# Altium schematic sheet Power.SchDoc
size A
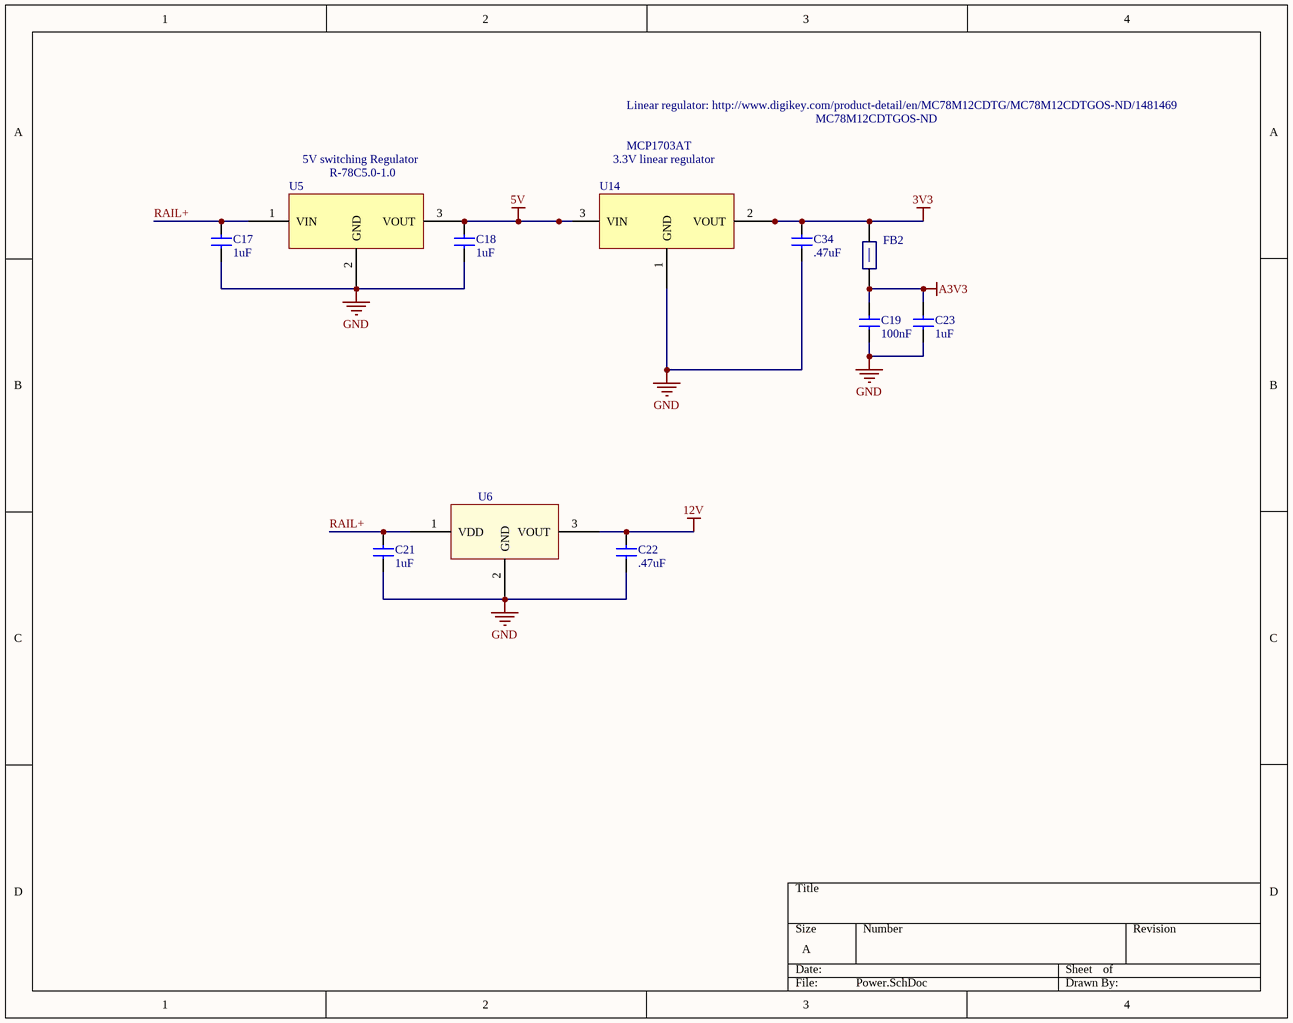
[diagram p0: Power.SchDoc]

## Parts
C17  value 1uF  [CAPC0603]  (hidden comment: Cap)
C18  value 1uF  [CAPC0603]  (hidden comment: Cap)
C19  value 100nF  [CAPC0603]  (hidden comment: Cap)
C21  value 1uF  [CAPC0603]  (hidden comment: Cap)
C22  value .47uF  [CAPC0603]  (hidden comment: Cap)
C23  value 1uF  [CAPC0603]  (hidden comment: Cap)
C34  value .47uF  [CAPC0603]  (hidden comment: Cap)
FB2  FBead  [RES0603]  (value not drawn)
U5  R-78C5.0-1.0  [R-78C5.0-1.0]
U6  MC78M12CDTG  [MC78M12CDTG]  (value not drawn)
U14  MCP1703AT  [MCP1703AT-xx02EMB]

## Nets
3V3: C34.1(A) FB2.2(B) U14.2(VOUT)
5V: C18.1(A) U5.3(VOUT) U14.3(VIN)
12V: C22.1(A) U6.3(VOUT)
A3V3: C19.1(A) C23.1(A) FB2.1(A)
GND: C17.2(B) C18.2(B) C19.2(B) C21.2(B) C22.2(B) C23.2(B) C34.2(B) U5.2(GND) U6.2(GND) U14.1(GND)
RAIL+: C17.1(A) C21.1(A) U5.1(VIN) U6.1(VDD)

## Notes on the sheet
- 5V switching Regulator
- 3.3V linear regulator
- Linear regulator: http://www.digikey.com/product-detail/en/MC78M12CDTG/MC78M12CDTGOS-ND/1481469
- MC78M12CDTGOS-ND

## Library data of the parts
FB2 = FBead: Ferrite Bead; Supplier 1: Digi-Key; Supplier Part Number 1: 445-2988-1-ND
U5 = R-78C5.0-1.0: CONV DC/DC 1A 5V OUT SIP VERT; Supplier 1: Digi-Key; Supplier Part Number 1: 945-1395-5-ND
U6 = MC78M12CDTG: IC REG LDO 12V 0.5A DPAK; Supplier 1: Digi-Key; Supplier Part Number 1: MC78M12CDTGOS-ND
U14 = MCP1703AT: 250 mA, 16V, Low Quiescent Current LDO Regulator; pin to pad: 2>3 3>2; Supplier 1: Digi-Key; Supplier Part Number 1: MCP1703AT-3302E/CBCT-ND
C17-C19 C21-C23 C34 = Cap: Supplier 1: Digi-Key
  C17 C18 C21 C23: Supplier Part Number 1: 1276-1860-1-ND
  C19: Supplier Part Number 1: 1276-1000-1-ND
  C22 C34: Supplier Part Number 1: 445-7465-1-ND